# EAGLE schematic star (EAGLE 9.6.2)
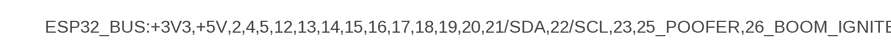
[diagram p0: schematic, sheet 1, part 1 of 2]
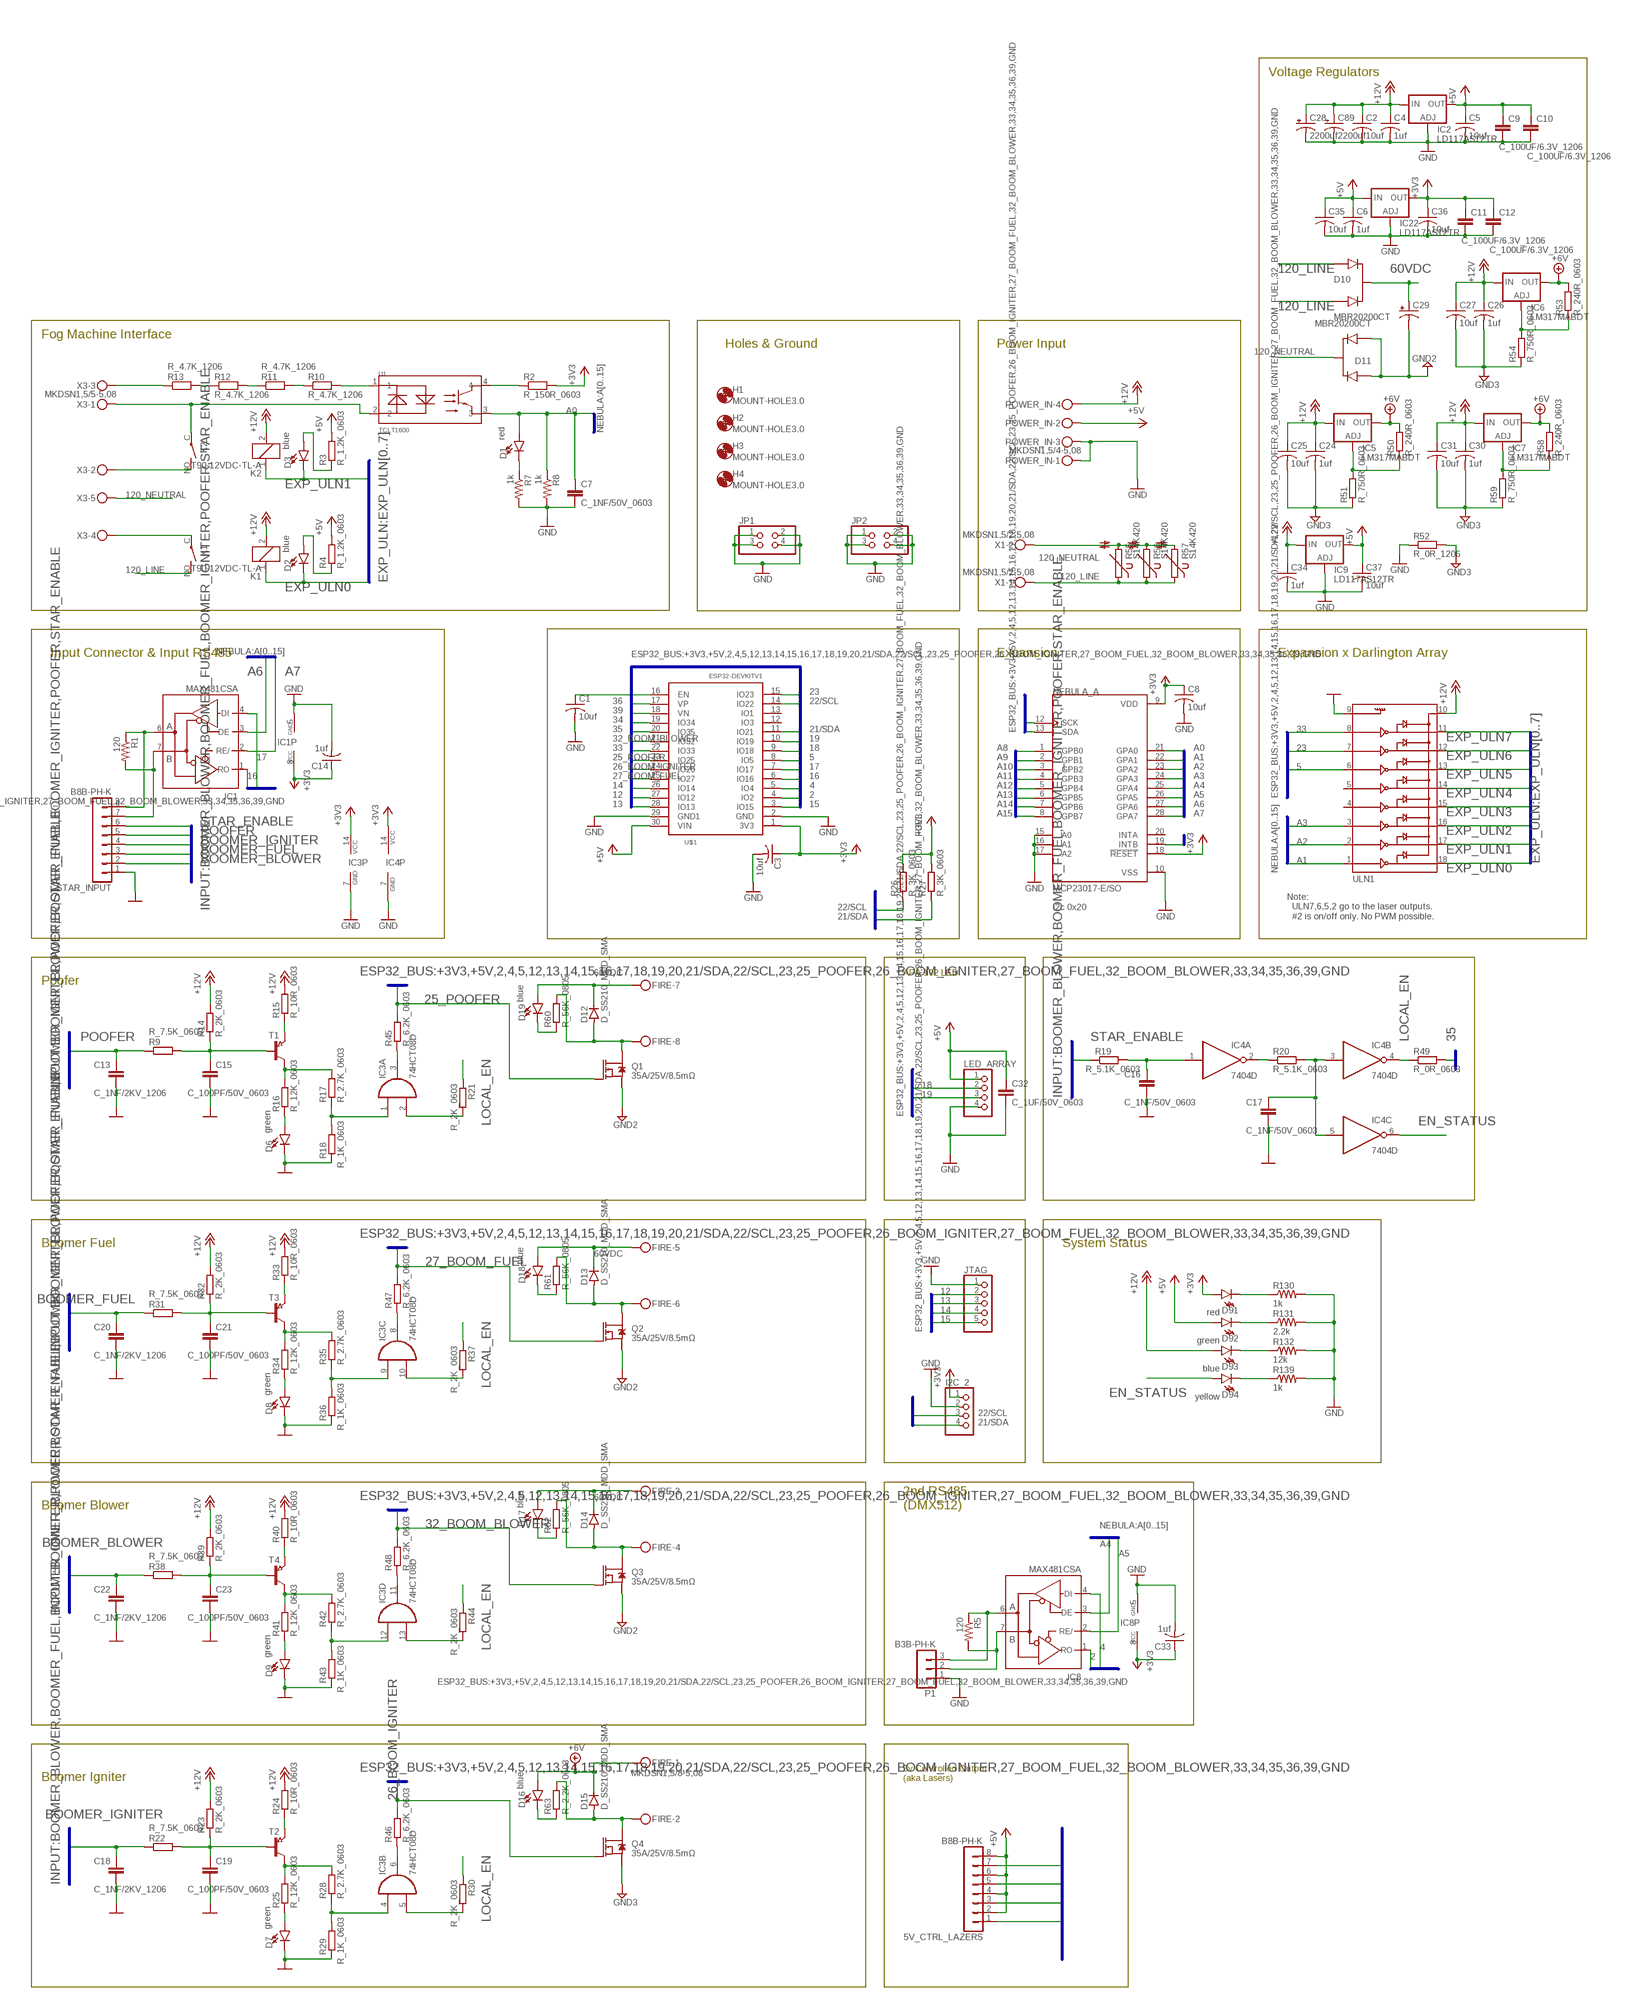
[diagram p1: schematic, sheet 1, part 2 of 2]

## Parts
5V_CTRL_LAZERS  B8B-PH-K  [B8B-PH-K]
C1  10uf  C-USC0603  [C0603]
C2  10uf  C-USC0603  [C0603]
C3  10uf  C-USC0603  [C0603]
C4  1uf  C-USC0805  [C0805]
C5  10uf  C-USC0603  [C0603]
C6  1uf  C-USC0805  [C0805]
C7  C_1NF/50V_0603  [C0603]
C8  10uf  C-USC0603  [C0603]
C9  C_100UF/6.3V_1206  [C1206]
C10  C_100UF/6.3V_1206  [C1206]
C11  C_100UF/6.3V_1206  [C1206]
C12  C_100UF/6.3V_1206  [C1206]
C13  C_1NF/2KV_1206  [C1206]
C14  1uf  C-USC0805  [C0805]
C15  C_100PF/50V_0603  [C0603]
C16  C_1NF/50V_0603  [C0603]
C17  C_1NF/50V_0603  [C0603]
C18  C_1NF/2KV_1206  [C1206]
C19  C_100PF/50V_0603  [C0603]
C20  C_1NF/2KV_1206  [C1206]
C21  C_100PF/50V_0603  [C0603]
C22  C_1NF/2KV_1206  [C1206]
C23  C_100PF/50V_0603  [C0603]
C24  1uf  C-USC0805  [C0805]
C25  10uf  C-USC0603  [C0603]
C26  1uf  C-USC0805  [C0805]
C27  10uf  C-USC0603  [C0603]
C28  2200uf  CPOL-USE5-13  [E5-13]
C29  CPOL-USE10-25  [EB25D]
C30  1uf  C-USC0805  [C0805]
C31  10uf  C-USC0603  [C0603]
C32  C_1UF/50V_0603  [C0603]
C33  1uf  C-USC0805  [C0805]
C34  1uf  C-USC0805  [C0805]
C35  10uf  C-USC0603  [C0603]
C36  10uf  C-USC0603  [C0603]
C37  10uf  C-USC0603  [C0603]
C89  2200uf  CPOL-USE5-13  [E5-13]
D1  red  LED0603  [LED-0603]
D2  blue  LED0603  [LED-0603]
D3  blue  LED0603  [LED-0603]
D6  green  LED0603  [LED-0603]
D7  green  LED0603  [LED-0603]
D8  green  LED0603  [LED-0603]
D9  green  LED0603  [LED-0603]
D10  MBR20200CT  [TO254P1050X476X2020-3]
D11  MBR20200CT  [TO254P1050X476X2020-3]
D12  D_SS210_MDD_SMA  [DO-214AC]
D13  D_SS210_MDD_SMA  [DO-214AC]
D14  D_SS210_MDD_SMA  [DO-214AC]
D15  D_SS210_MDD_SMA  [DO-214AC]
D16  blue  LED0603  [LED-0603]
D17  blue  LED0603  [LED-0603]
D18  blue  LED0603  [LED-0603]
D19  blue  LED0603  [LED-0603]
D91  red  LED0603  [LED-0603]
D92  green  LED0603  [LED-0603]
D93  blue  LED0603  [LED-0603]
D94  yellow  LED0603  [LED-0603]
FIRE  MKDSN1,5/8-5,08  [MKDSN1,5/8-5,08]
H1  MOUNT-HOLE3.0  [3,0]
H2  MOUNT-HOLE3.0  [3,0]
H3  MOUNT-HOLE3.0  [3,0]
H4  MOUNT-HOLE3.0  [3,0]
I2C_2  PINHD-1X4  [1X04]
IC1  MAX481CSA  [SO08]
IC2  LD117AS12TR  [SOT223]
IC3  74HCT08D  [SO14]
IC4  7404D  [SO14]
IC5  LM317MABDT  [DPACK]
IC6  LM317MABDT  [DPACK]
IC7  LM317MABDT  [DPACK]
IC8  MAX481CSA  [SO08]
IC9  LD117AS12TR  [SOT223]
IC22  LD117AS12TR  [SOT223]
JP1  PINHD-2X2  [2X02]
JP2  PINHD-2X2  [2X02]
JTAG  PINHD-1X5  [1X05]
K1  T90-12VDC-TL-A  JT1A-PCB-DC12V  [JT1A-PCB]
K2  T90-12VDC-TL-A  JT1A-PCB-DC12V  [JT1A-PCB]
LED_ARRAY  PINHD-1X4  [1X04]
NEBULA_A  MCP23017-E/SO  [SOIC127P1030X265-28N]
P1  B3B-PH-K  [B3B-PH-K]
POWER_IN  MKDSN1,5/4-5,08  [MKDSN1,5/4-5,08]
Q1  35A/25V/8.5mΩ  MOSFET-NCH-FDD8780  [DPAK]
Q2  35A/25V/8.5mΩ  MOSFET-NCH-FDD8780  [DPAK]
Q3  35A/25V/8.5mΩ  MOSFET-NCH-FDD8780  [DPAK]
Q4  35A/25V/8.5mΩ  MOSFET-NCH-FDD8780  [DPAK]
R1  120  R-US_R0603  [R0603]
R2  R_150R_0603  [R0603]
R3  R_1.2K_0603  [R0603]
R4  R_1.2K_0603  [R0603]
R5  120  R-US_R0603  [R0603]
R7  1k  R-US_R0603  [R0603]
R8  1k  R-US_R0603  [R0603]
R9  R_7.5K_0603  [R0603]
R10  R_4.7K_1206  [R1206]
R11  R_4.7K_1206  [R1206]
R12  R_4.7K_1206  [R1206]
R13  R_4.7K_1206  [R1206]
R14  R_2K_0603  [R0603]
R15  R_10R_0603  [R0603]
R16  R_12K_0603  [R0603]
R17  R_2.7K_0603  [R0603]
R18  R_1K_0603  [R0603]
R19  R_5.1K_0603  [R0603]
R20  R_5.1K_0603  [R0603]
R21  R_2K_0603  [R0603]
R22  R_7.5K_0603  [R0603]
R23  R_2K_0603  [R0603]
R24  R_10R_0603  [R0603]
R25  R_12K_0603  [R0603]
R26  R_3K_0603  [R0603]
R27  R_3K_0603  [R0603]
R28  R_2.7K_0603  [R0603]
R29  R_1K_0603  [R0603]
R30  R_2K_0603  [R0603]
R31  R_7.5K_0603  [R0603]
R32  R_2K_0603  [R0603]
R33  R_10R_0603  [R0603]
R34  R_12K_0603  [R0603]
R35  R_2.7K_0603  [R0603]
R36  R_1K_0603  [R0603]
R37  R_2K_0603  [R0603]
R38  R_7.5K_0603  [R0603]
R39  R_2K_0603  [R0603]
R40  R_10R_0603  [R0603]
R41  R_12K_0603  [R0603]
R42  R_2.7K_0603  [R0603]
R43  R_1K_0603  [R0603]
R44  R_2K_0603  [R0603]
R45  R_6.2K_0603  [R0603]
R46  R_6.2K_0603  [R0603]
R47  R_6.2K_0603  [R0603]
R48  R_6.2K_0603  [R0603]
R49  R_0R_0603  [R0603]
R50  R_240R_0603  [R0603]
R51  R_750R_0603  [R0603]
R52  R_0R_1206  [R1206]
R53  R_240R_0603  [R0603]
R54  R_750R_0603  [R0603]
R55  S14K420  [S14K420]
R56  S14K420  [S14K420]
R57  S14K420  [S14K420]
R58  R_240R_0603  [R0603]
R59  R_750R_0603  [R0603]
R60  R_56K_0805  [R0805]
R61  R_56K_0805  [R0805]
R62  R_56K_0805  [R0805]
R63  R_2.2K_0603  [R0603]
R130  1k  R-US_R0603  [R0603]
R131  2.2k  R-US_R0603  [R0603]
R132  12k  R-US_R0603  [R0603]
R139  1k  R-US_R0603  [R0603]
STAR_INPUT  B8B-PH-K  [B8B-PH-K]
T1  T_PNP_MMBT5401_CHANGJ_SOT23-BEC  [SOT23]
T2  T_PNP_MMBT5401_CHANGJ_SOT23-BEC  [SOT23]
T3  T_PNP_MMBT5401_CHANGJ_SOT23-BEC  [SOT23]
T4  T_PNP_MMBT5401_CHANGJ_SOT23-BEC  [SOT23]
U1  TCLT1600  [SOP254P1015X230-4N]
U$1  ESP32DEVKITV1  [ESP32-DEVKITV1]
ULN1  ULN2803SOICW  [SO18L]
X1  MKDSN1,5/2-5,08  [MKDSN1,5/2-5,08]
X3  MKDSN1,5/5-5,08  [MKDSN1,5/5-5,08]

## Nets
2: IC8.1(RO) U$1.4(IO2)
4: IC8.4(DI) U$1.5(IO4)
5: U$1.8(IO5) ULN1.6
12: JTAG.2 U$1.27(IO12)
13 [3V3]: JTAG.3 U$1.28(IO13)
14: JTAG.4 U$1.26(IO14)
15: JTAG.5 U$1.3(IO15)
16: IC1.1(RO) U$1.6(IO16)
17: IC1.4(DI) U$1.7(IO17)
18: LED_ARRAY.2 U$1.9(IO18)
19: LED_ARRAY.3 U$1.10(IO19)
21/SDA: I2C_2.4 NEBULA_A.13(SDA) R27.1 U$1.11(IO21)
22/SCL: I2C_2.3 NEBULA_A.12(SCK) R26.1 U$1.14(IO22)
23: U$1.15(IO23) ULN1.7
25_POOFER: Q1.1(G) R45.2 U$1.23(IO25)
26_BOOM_IGNITER: Q4.1(G) R46.2 U$1.24(IO26)
27_BOOM_FUEL: Q2.1(G) R47.2 U$1.25(IO27)
32_BOOM_BLOWER: Q3.1(G) R48.2 U$1.21(IO32)
33: U$1.22(IO33) ULN1.8
34: NEBULA_A.19(INTB) U$1.19(IO34)
35: R49.2 U$1.20(IO35)
36: U$1.17(VP)
39: U$1.18(VN)
60VDC [60V]: C29.+ D10.2(C) D12.C D13.C D14.C D17.A D18.A D19.A FIRE.3 FIRE.5 FIRE.7
120_LINE [120VAC_PWR]: D10.1(A1) D10.3(A2) K1.NO(S) R55.1 R56.1 R57.1 X1.1
120_NEUTRAL [120VAC_PWR]: D11.2(C) R55.2 R56.2 R57.2 X1.2 X3.5
+3V3 [3V3]: C3.1 C8.1 C11.1 C12.1 C14.1 C33.1 C36.1 D91.A I2C_2.1 IC1.8(VCC) IC3.14(P:VCC) IC4.14(P:VCC) IC8.8(VCC) IC22.4(OUT) NEBULA_A.9(VDD) NEBULA_A.18(!RESET) R2.2 R26.2 R27.2 U$1.1(3V3)
+5V [5V]: 5V_CTRL_LAZERS.2 5V_CTRL_LAZERS.4 5V_CTRL_LAZERS.6 5V_CTRL_LAZERS.8 C5.1 C6.1 C9.1 C10.1 C32.1 C35.1 C37.1 D92.A IC2.4(OUT) IC9.4(OUT) IC22.3(IN) LED_ARRAY.1 POWER_IN.2 R3.2 R4.2 U$1.30(VIN)
+6V: D15.C D16.A FIRE.1 IC5.4(OUT) IC6.4(OUT) IC7.4(OUT) R50.2 R53.2 R58.2
+12V [12V]: C2.1 C4.1 C24.1 C25.1 C26.1 C27.1 C28.+ C30.1 C31.1 C34.1 C89.+ D93.A IC2.3(IN) IC5.3(IN) IC6.3(IN) IC7.3(IN) IC9.3(IN) K1.2 K2.2 POWER_IN.4 R14.2 R15.2 R23.2 R24.2 R32.2 R33.2 R39.2 R40.2 ULN1.10
A0: C7.1 D1.A NEBULA_A.21(GPA0) R8.1 U1.3
A1: NEBULA_A.22(GPA1) ULN1.1
A2: NEBULA_A.23(GPA2) ULN1.2
A3: NEBULA_A.24(GPA3) ULN1.3
A4: IC8.3(DE) NEBULA_A.25(GPA4)
A5: IC8.2(RE/) NEBULA_A.26(GPA5)
A6: IC1.3(DE) NEBULA_A.27(GPA6)
A7: IC1.2(RE/) NEBULA_A.28(GPA7)
A8: NEBULA_A.1(GPB0)
A9: NEBULA_A.2(GPB1)
A10: NEBULA_A.3(GPB2)
A11: NEBULA_A.4(GPB3)
A12: NEBULA_A.5(GPB4)
A13: NEBULA_A.6(GPB5)
A14: NEBULA_A.7(GPB6)
A15: NEBULA_A.8(GPB7)
BOOMER_BLOWER: C22.1 R38.1 STAR_INPUT.2
BOOMER_FUEL: C20.1 R31.1 STAR_INPUT.3
BOOMER_IGNITER: C18.1 R22.1 STAR_INPUT.4
EN_STATUS: D94.A IC4.6(C:O)
EXP_ULN0: D2.C K1.1 ULN1.18
EXP_ULN1: D3.C K2.1 ULN1.17
EXP_ULN2: 5V_CTRL_LAZERS.7 ULN1.16
EXP_ULN3: ULN1.15
EXP_ULN4: ULN1.14
EXP_ULN5: 5V_CTRL_LAZERS.5 ULN1.13
EXP_ULN6: 5V_CTRL_LAZERS.3 ULN1.12
EXP_ULN7: 5V_CTRL_LAZERS.1 ULN1.11
GND [GND]: C1.2 C2.2 C3.2 C4.2 C5.2 C6.2 C7.2 C8.2 C9.2 C10.2 C11.2 C12.2 C13.2 C14.2 C15.2 C16.2 C17.2 C18.2 C19.2 C20.2 C21.2 C22.2 C23.2 C28.- C32.2 C33.2 C34.2 C35.2 C36.2 C37.2 C89.- D6.C D7.C D8.C D9.C I2C_2.2 IC1.5(GND) IC2.1(ADJ) IC3.7(P:GND) IC4.7(P:GND) IC8.5(GND) IC9.1(ADJ) IC22.1(ADJ) JP1.1 JP1.2 JP1.3 JP1.4 JP2.1 JP2.2 JP2.3 JP2.4 JTAG.1 LED_ARRAY.4 NEBULA_A.10(VSS) NEBULA_A.15(A0) NEBULA_A.16(A1) NEBULA_A.17(A2) P1.1 POWER_IN.1 POWER_IN.3 R7.2 R8.2 R18.1 R29.1 R36.1 R43.1 R52.1 R130.2 R131.2 R132.2 R139.2 STAR_INPUT.1 U$1.2(GND) U$1.29(GND1) ULN1.9
GND2 [60V]: C29.- D11.1(A1) D11.3(A2) Q1.3(S) Q2.3(S) Q3.3(S)
GND3: C24.2 C25.2 C26.2 C27.2 C30.2 C31.2 Q4.3(S) R51.1 R52.2 R54.1 R59.1
LOCAL_EN: IC4.4(B:O) R21.1 R30.1 R37.1 R44.1 R49.1
N$1: C1.1 U$1.16(EN)
N$2: R2.1 U1.4
N$3: D2.A R4.1
N$4: D3.A R3.1
N$5: IC8.7(B) P1.2 R5.2
N$6: IC8.6(A) P1.3 R5.1
N$7 [120VAC]: R13.1 X3.3
N$8 [120VAC]: R12.1 R13.2
N$9 [120VAC]: R11.1 R12.2
N$10 [120VAC]: R10.1 R11.2
N$11 [120VAC]: R10.2 U1.1
N$12: D1.C R7.1
N$13 [120VAC]: K2.NO(S) X3.2
N$14 [120VAC_PWR]: K1.C(P) X3.4
N$15 [120VAC]: K2.C(P) U1.2 X3.1
N$16: R16.2 R17.2 T1.3(C)
N$17: C15.1 R9.2 R14.1 T1.1(B)
N$18: D6.A R16.1
N$19: IC3.1(A:I0) R17.1 R18.2
N$20: R15.1 T1.2(E)
N$21: IC4.2(A:O) R20.1
N$22: C17.1 IC4.3(B:I) IC4.5(C:I) R20.2
N$23: C16.1 IC4.1(A:I) R19.2
N$24: IC3.2(A:I1) R21.2
N$25: C19.1 R22.2 R23.1 T2.1(B)
N$26: R25.2 R28.2 T2.3(C)
N$27: D7.A R25.1
N$28: IC3.4(B:I0) R28.1 R29.2
N$29: R24.1 T2.2(E)
N$30: IC3.5(B:I1) R30.2
N$31: C21.1 R31.2 R32.1 T3.1(B)
N$32: R34.2 R35.2 T3.3(C)
N$33: D8.A R34.1
N$34: IC3.9(C:I0) R35.1 R36.2
N$35: R33.1 T3.2(E)
N$36: IC3.10(C:I1) R37.2
N$37: C23.1 R38.2 R39.1 T4.1(B)
N$38: R41.2 R42.2 T4.3(C)
N$39: D9.A R41.1
N$40: IC3.12(D:I0) R42.1 R43.2
N$41: R40.1 T4.2(E)
N$42: IC3.13(D:I1) R44.2
N$43: IC3.3(A:O) R45.1
N$44: IC3.6(B:O) R46.1
N$45: IC3.8(C:O) R47.1
N$46: IC3.11(D:O) R48.1
N$47: D13.A FIRE.6 Q2.4(D) R61.2
N$48: IC6.1(ADJ) R53.1 R54.2
N$49: D12.A FIRE.8 Q1.4(D) R60.2
N$50: IC5.1(ADJ) R50.1 R51.2
N$51: D14.A FIRE.4 Q3.4(D) R62.2
N$52: D15.A FIRE.2 Q4.4(D) R63.2
N$53: IC7.1(ADJ) R58.1 R59.2
N$54: D16.C R63.1
N$55: D17.C R62.1
N$56: D18.C R61.1
N$57: D19.C R60.1
N$108: IC1.7(B) R1.2 STAR_INPUT.7
N$109: IC1.6(A) R1.1 STAR_INPUT.8
N$156: D91.C R130.1
N$157: D92.C R131.1
N$158: D93.C R132.1
N$159: D94.C R139.1
POOFER: C13.1 R9.1 STAR_INPUT.5
STAR_ENABLE: R19.1 STAR_INPUT.6
Unconnected: IC4.8(D:O) IC4.9(D:I) IC4.10(E:O) IC4.11(E:I) IC4.12(F:O) IC4.13(F:I) NEBULA_A.20(INTA) U$1.12(IO3) U$1.13(IO1) ULN1.4 ULN1.5

## Buses
ESP32_BUS:+3V3,+5V,2,4,5,12,13,14,15,16,17,18,19,20,21/SDA,22/SCL,23,25_POOFER,26_BOOM_IGNITER,27_BOOM_FUEL,32_BOOM_BLOWER,33,34,35,36,39,GND
NEBULA:A[0..15]
EXP_ULN:EXP_ULN[0..7]
INPUT:BOOMER_BLOWER,BOOMER_FUEL,BOOMER_IGNITER,POOFER,STAR_ENABLE

## Notes on the sheet
- Voltage Regulators
- Fog Machine Interface
- Holes & Ground | Power Input
- Input Connector & Input RS485 | Expansion | Expansion x Darlington Array
- i2c 0x20
- Note:
    ULN7,6,5,2 go to the laser outputs.
    #2 is on/off only. No PWM possible.
- APA 102 LED
- Poofer
- Boomer Fuel | System Status
- Boomer Blower
- 2nd RS485
  (DMX512)
- Boomer Igniter
- 5v Controlled Output
  (aka Lasers)

## Library data of the parts
5V_CTRL_LAZERS STAR_INPUT = con-jst-ph:B8B-PH-K: HEADER
C1-C3 C5 C8 C25 C27 C31 C35-C37 = rcl:C-US: CAPACITOR, American symbol; LCSC_PART: C19702; SPICEPREFIX: C
C4 C6 C14 C24 C26 C30 C33 C34 = rcl:C-US: CAPACITOR, American symbol; LCSC_PART: C15849; SPICEPREFIX: C
C7 C16 C17 = JLC PCB Basic Parts_loc:C_: Capacitor General purpose SMD Capacitor; LCSC_DATASHEET: https://datasheet.lcsc.com/lcsc/1811071810_Samsung-Electro-Mechanics-CL10B102KB8NNNC_C1588.pdf; LCSC_PART: C1588; LCSC_ROTATION_CCW: 0; LCSC_STOCK: 2243141; PROPERTIES: 50V 1nF X7R ±10% 0603 ROHS
C9-C12 = JLC PCB Basic Parts_loc:C_: Capacitor General purpose SMD Capacitor; LCSC_DATASHEET: https://datasheet.lcsc.com/lcsc/1810301816_Samsung-Electro-Mechanics-CL31A107MQHNNNE_C15008.pdf; LCSC_PART: C15008; LCSC_ROTATION_CCW: 0; LCSC_STOCK: 547696; PROPERTIES: 6.3V 100uF X5R ±20% 1206 ROHS
C13 C18 C20 C22 = JLC PCB Basic Parts_loc:C_: Capacitor General purpose SMD Capacitor; LCSC_DATASHEET: https://datasheet.lcsc.com/lcsc/1810311314_FH-Guangdong-Fenghua-Advanced-Tech-1206B102K202NT_C9196.pdf; LCSC_PART: C9196; LCSC_ROTATION_CCW: 0; LCSC_STOCK: 8943689; PROPERTIES: 2kV 1nF X7R ±10% 1206 ROHS
C15 C19 C21 C23 = JLC PCB Basic Parts_loc:C_: Capacitor General purpose SMD Capacitor; LCSC_DATASHEET: https://datasheet.lcsc.com/lcsc/1811151136_Samsung-Electro-Mechanics-CL10C101JB8NNNC_C14858.pdf; LCSC_PART: C14858; LCSC_ROTATION_CCW: 0; LCSC_STOCK: 2152181; PROPERTIES: 50V 100pF C0G ±5% 0603 ROHS
C28 C89 = rcl:CPOL-US: POLARIZED CAPACITOR, American symbol; DIST: https://amzn.to/3iR84VS; SPICEPREFIX: C
C29 = rcl:CPOL-US: POLARIZED CAPACITOR, American symbol; SPICEPREFIX: C
C32 = JLC PCB Basic Parts_loc:C_: Capacitor General purpose SMD Capacitor; LCSC_DATASHEET: https://datasheet.lcsc.com/lcsc/1810261812_Samsung-Electro-Mechanics-CL10A105KB8NNNC_C15849.pdf; LCSC_PART: C15849; LCSC_ROTATION_CCW: 0; LCSC_STOCK: 14650365; PROPERTIES: 50V 1uF X5R ±10% 0603 ROHS
D1 D91 = SparkFun-LED:LED: LED (Generic) Standard schematic elements and footprints for 5mm, 3mm, 1206, and 0603 sized LEDs. Generic LEDs with no color specified.; JLC_ROTATION: 180; LCSC_PART: C2286
D2 D3 D16-D19 D93 = SparkFun-LED:LED: LED (Generic) Standard schematic elements and footprints for 5mm, 3mm, 1206, and 0603 sized LEDs. Generic LEDs with no color specified.; JLC_ROTATION: 180; LCSC_PART: C72041
D6-D9 D92 = SparkFun-LED:LED: LED (Generic) Standard schematic elements and footprints for 5mm, 3mm, 1206, and 0603 sized LEDs. Generic LEDs with no color specified.; JLC_ROTATION: 180; LCSC_PART: C72043
D10 D11 = MBR20200CT:MBR20200CT: Check availability <https://pricing.snapeda.com/parts/MBR20200CT/Taiwan%20Semiconductor/view-part?ref=eda>; AVAILABILITY: In Stock; DESCRIPTION: 20A, 200V, Schottky Rectifier; MF: Taiwan Semiconductor; MP: MBR20200CT; PACKAGE: TO-220AB-3 Taiwan Semiconductor; PRICE: None; PURCHASE-URL: https://pricing.snapeda.com/search/part/MBR20200CT/?ref=eda
D12-D15 = JLC PCB Basic Parts_loc:D_: Diode; LCSC_DATASHEET: https://datasheet.lcsc.com/lcsc/1811071613_MDD-Microdiode-Electronics--SS210_C14996.pdf; LCSC_PART: C14996; LCSC_ROTATION_CCW: 180; LCSC_STOCK: 307807; PROPERTIES: 100V 850mV@2A 2A SMA(DO-214AC) Schottky Barrier Diodes (SBD) ROHS
D94 = SparkFun-LED:LED: LED (Generic) Standard schematic elements and footprints for 5mm, 3mm, 1206, and 0603 sized LEDs. Generic LEDs with no color specified.; JLC_ROTATION: 180; LCSC_PART: C72038
FIRE = con-phoenix-508:MKDSN1,5/8-5,08: MKDSN 1,5/ 8-5,08 Printklemme Nennstrom: 13,5 A Nennspannung: 250 V Rastermaß: 5,08 mm Polzahl: 8 Anschlussart: Schraubanschluss Montage: Löten Anschlussrichtung Leiter/Platine: 0 ° Artikelnummer: 1729186 Source: http://eshop.phoenixcontact.com .. 1729186.pdf
H1-H4 = holes:MOUNT-HOLE: MOUNTING HOLE with drill center marker
I2C_2 LED_ARRAY = pinhead:PINHD-1X4: PIN HEADER
IC1 IC8 = maxim:MAX481CSA: RS485 TRANSEIVER; LCSC_PART: C8963; MF: MAXIM; MPN: MAX481CSA; OC_FARNELL: unknown; OC_NEWARK: 90C3817
IC2 IC9 = v-reg:LD117A?*: Low drop fixed and adjustable positive voltage regulators 1 A Source: http://www.st.com/stonline/products/literature/ds/7194/ld1117axx.pdf; LCSC_PART: C6187; PRICE: 0.5
IC3 = 74xx-eu:74*08: Quad 2-input AND gate; LCSC_PART: C5593
IC4 = 74xx-us:74*04: Hex INVERTER; LCSC_PART: C5590
IC5-IC7 = v-reg:LM317?*: 500 mA Adjustable Output Positive Voltage Regulator Source: http://www.onsemi.co.jp .. LM317M-D.PDF; LCSC_PART: C75510; PRICE: 0.5
IC22 = v-reg:LD117A?*: Low drop fixed and adjustable positive voltage regulators 1 A Source: http://www.st.com/stonline/products/literature/ds/7194/ld1117axx.pdf; LCSC_PART: C347222; PRICE: 0.5
JP1 JP2 = pinhead:PINHD-2X2: PIN HEADER
JTAG = pinhead:PINHD-1X5: PIN HEADER
K1 K2 = relay:JT1A?-*: COMPACT ECONOMICAL 30 AMP. RELAY NAiS Source: http://www.mew-europe.com/.. en_ds_61212_0000.pdf; OC_FARNELL: unknown; OC_NEWARK: unknown
NEBULA_A = MCP23017-E_SO:MCP23017-E/SO: MCP23017 Series 5.5 V 1.7 MHz SMT 16-Bit I2C I/O Expander - SOIC-28 Check availability <https://pricing.snapeda.com/parts/MCP23017-E/SO/Microchip/view-part?ref=eda>; AVAILABILITY: In Stock; DESCRIPTION: I/O Expander 16 I²C 1.7 MHz 28-SOIC; LCSC_PART: C629440; MF: Microchip; MP: MCP23017-E/SO; PACKAGE: SOIC-28 Microchip; PRICE: None; PURCHASE-URL: https://pricing.snapeda.com/search/part/MCP23017-E/SO/?ref=eda
P1 = con-jst-ph:B3B-PH-K: HEADER
POWER_IN = con-phoenix-508:MKDSN1,5/4-5,08: MKDSN 1,5/ 4-5,08 Printklemme Nennstrom: 13,5 A Nennspannung: 250 V Rastermaß: 5,08 mm Polzahl: 4 Anschlussart: Schraubanschluss Montage: Löten Anschlussrichtung Leiter/Platine: 0 ° Artikelnummer: 1729144 Source: http://eshop.phoenixcontact.com .. 1729144.pdf
Q1-Q4 = SparkFun-DiscreteSemi:MOSFET-NCH: N-channel MOSFETs Voltage controlled devices that allow control of high current outputs. SparkFun Products: SparkFun OpenScale <https://www.sparkfun.com/products/13261> SparkFun Digital Sandbox <https://www.sparkfun.com/products/12651> SparkFun Monster Moto Shield <https://www.sparkfun.com/products/10182> SparkFun MOSFET Power Controller <https://www.sparkfun.com/products/11214>; LCSC_PART: C2995335; PROD_ID: TRANS-09984
R1 R5 = rcl:R-US_: RESISTOR, American symbol; LCSC_PART: C22787; SPICEPREFIX: R
R2 = JLC PCB Basic Parts_loc:R_: Resistor General purpose SMD Resistor; LCSC_DATASHEET: https://datasheet.lcsc.com/lcsc/2110252030_UNI-ROYAL-Uniroyal-Elec-0603WAF1500T5E_C22808.pdf; LCSC_PART: C22808; LCSC_ROTATION_CCW: 0; LCSC_STOCK: 466893; PROPERTIES: ±1% 1/10W Thick Film Resistors 75V ±100ppm -55°C~+155°C 150Ohm 0603 ROHS
R3 R4 = JLC PCB Basic Parts_loc:R_: Resistor General purpose SMD Resistor; LCSC_DATASHEET: https://datasheet.lcsc.com/lcsc/2110252030_UNI-ROYAL-Uniroyal-Elec-0603WAF1201T5E_C22765.pdf; LCSC_PART: C22765; LCSC_ROTATION_CCW: 0; LCSC_STOCK: 476320; PROPERTIES: ±1% 1/10W Thick Film Resistors 75V ±100ppm -55°C~+155°C 1.2kOhm 0603 ROHS
R7 R8 R130 R139 = rcl:R-US_: RESISTOR, American symbol; LCSC_PART: C21190; SPICEPREFIX: R
R9 R22 R31 R38 = JLC PCB Basic Parts_loc:R_: Resistor General purpose SMD Resistor; LCSC_DATASHEET: https://datasheet.lcsc.com/lcsc/2110252130_UNI-ROYAL-Uniroyal-Elec-0603WAF7501T5E_C23234.pdf; LCSC_PART: C23234; LCSC_ROTATION_CCW: 0; LCSC_STOCK: 230039; PROPERTIES: ±1% 1/10W Thick Film Resistors 75V ±100ppm -55°C~+155°C 7.5kOhm 0603 ROHS
R10-R13 = JLC PCB Basic Parts_loc:R_: Resistor General purpose SMD Resistor; LCSC_DATASHEET: https://datasheet.lcsc.com/lcsc/2110251930_UNI-ROYAL-Uniroyal-Elec-1206W4F4701T5E_C17936.pdf; LCSC_PART: C17936; LCSC_ROTATION_CCW: 0; LCSC_STOCK: 161665; PROPERTIES: ±1% 250mW Thick Film Resistors 200V ±100ppm -55°C~+155°C 4.7kOhm 1206 ROHS
R14 R21 R23 R30 R32 R37 R39 R44 = JLC PCB Basic Parts_loc:R_: Resistor General purpose SMD Resistor; LCSC_DATASHEET: https://datasheet.lcsc.com/lcsc/2110252130_UNI-ROYAL-Uniroyal-Elec-0603WAF2001T5E_C22975.pdf; LCSC_PART: C22975; LCSC_ROTATION_CCW: 0; LCSC_STOCK: 3372290; PROPERTIES: ±1% 1/10W Thick Film Resistors 75V ±100ppm -55°C~+155°C 2kOhm 0603 ROHS
R15 R24 R33 R40 = JLC PCB Basic Parts_loc:R_: Resistor General purpose SMD Resistor; LCSC_DATASHEET: https://datasheet.lcsc.com/lcsc/2110252030_UNI-ROYAL-Uniroyal-Elec-0603WAF100JT5E_C22859.pdf; LCSC_PART: C22859; LCSC_ROTATION_CCW: 0; LCSC_STOCK: 2733989; PROPERTIES: ±1% 1/10W Thick Film Resistors 75V ±400ppm -55°C~+155°C 10Ohm 0603 ROHS
R16 R25 R34 R41 = JLC PCB Basic Parts_loc:R_: Resistor General purpose SMD Resistor; LCSC_DATASHEET: https://datasheet.lcsc.com/lcsc/2110252030_UNI-ROYAL-Uniroyal-Elec-0603WAF1202T5E_C22790.pdf; LCSC_PART: C22790; LCSC_ROTATION_CCW: 0; LCSC_STOCK: 256802; PROPERTIES: ±1% 1/10W Thick Film Resistors 75V ±100ppm -55°C~+155°C 12kOhm 0603 ROHS
R17 R28 R35 R42 = JLC PCB Basic Parts_loc:R_: Resistor General purpose SMD Resistor; LCSC_DATASHEET: https://datasheet.lcsc.com/lcsc/2110251730_UNI-ROYAL-Uniroyal-Elec-0603WAF2701T5E_C13167.pdf; LCSC_PART: C13167; LCSC_ROTATION_CCW: 0; LCSC_STOCK: 65542; PROPERTIES: ±1% 1/10W Thick Film Resistors 75V ±100ppm -55°C~+155°C 2.7kOhm 0603 ROHS
R18 R29 R36 R43 = JLC PCB Basic Parts_loc:R_: Resistor General purpose SMD Resistor; LCSC_DATASHEET: https://datasheet.lcsc.com/lcsc/2110252030_UNI-ROYAL-Uniroyal-Elec-0603WAF1001T5E_C21190.pdf; LCSC_PART: C21190; LCSC_ROTATION_CCW: 0; LCSC_STOCK: 5175299; PROPERTIES: ±1% 1/10W Thick Film Resistors 75V ±100ppm -55°C~+155°C 1kOhm 0603 ROHS
R19 R20 = JLC PCB Basic Parts_loc:R_: Resistor General purpose SMD Resistor; LCSC_DATASHEET: https://datasheet.lcsc.com/lcsc/2110252130_UNI-ROYAL-Uniroyal-Elec-0603WAF5101T5E_C23186.pdf; LCSC_PART: C23186; LCSC_ROTATION_CCW: 0; LCSC_STOCK: 2912883; PROPERTIES: ±1% 1/10W Thick Film Resistors 75V ±100ppm -55°C~+155°C 5.1kOhm 0603 ROHS
R26 R27 = JLC PCB Basic Parts_loc:R_: Resistor General purpose SMD Resistor; LCSC_DATASHEET: https://datasheet.lcsc.com/lcsc/2110251730_UNI-ROYAL-Uniroyal-Elec-0603WAF3001T5E_C4211.pdf; LCSC_PART: C4211; LCSC_ROTATION_CCW: 0; LCSC_STOCK: 740793; PROPERTIES: ±1% 1/10W Thick Film Resistors 75V ±100ppm -55°C~+155°C 3kOhm 0603 ROHS
R45-R48 = JLC PCB Basic Parts_loc:R_: Resistor General purpose SMD Resistor; LCSC_DATASHEET: https://datasheet.lcsc.com/lcsc/2110251730_UNI-ROYAL-Uniroyal-Elec-0603WAF6201T5E_C4260.pdf; LCSC_PART: C4260; LCSC_ROTATION_CCW: 0; LCSC_STOCK: 176806; PROPERTIES: ±1% 1/10W Thick Film Resistors 75V ±100ppm -55°C~+155°C 6.2kOhm 0603 ROHS
R49 = JLC PCB Basic Parts_loc:R_: Resistor General purpose SMD Resistor; LCSC_DATASHEET: https://datasheet.lcsc.com/lcsc/2110252030_UNI-ROYAL-Uniroyal-Elec-0603WAF0000T5E_C21189.pdf; LCSC_PART: C21189; LCSC_ROTATION_CCW: 0; LCSC_STOCK: 891306; PROPERTIES: ±1% 1/10W Thick Film Resistors 75V -55°C~+155°C 0Ohm 0603 ROHS
R50 R53 R58 = JLC PCB Basic Parts_loc:R_: Resistor General purpose SMD Resistor; LCSC_DATASHEET: https://datasheet.lcsc.com/lcsc/2110252230_UNI-ROYAL-Uniroyal-Elec-0603WAF2400T5E_C23350.pdf; LCSC_PART: C23350; LCSC_ROTATION_CCW: 0; LCSC_STOCK: 173950; PROPERTIES: ±1% 1/10W Thick Film Resistors 75V ±100ppm -55°C~+155°C 240Ohm 0603 ROHS
R51 R54 R59 = JLC PCB Basic Parts_loc:R_: Resistor General purpose SMD Resistor; LCSC_DATASHEET: https://datasheet.lcsc.com/lcsc/2110252130_UNI-ROYAL-Uniroyal-Elec-0603WAF7500T5E_C23241.pdf; LCSC_PART: C23241; LCSC_ROTATION_CCW: 0; LCSC_STOCK: 59351; PROPERTIES: ±1% 1/10W Thick Film Resistors 75V ±100ppm -55°C~+155°C 750Ohm 0603 ROHS
R52 = JLC PCB Basic Parts_loc:R_: Resistor General purpose SMD Resistor; LCSC_DATASHEET: https://datasheet.lcsc.com/lcsc/2110251930_UNI-ROYAL-Uniroyal-Elec-1206W4F0000T5E_C17888.pdf; LCSC_PART: C17888; LCSC_ROTATION_CCW: 0; LCSC_STOCK: 399166; PROPERTIES: ±1% 250mW Thick Film Resistors 200V ±800ppm -55°C~+155°C 0Ohm 1206 ROHS
R55-R57 = varistor:S14K420: VARISTOR
R60-R62 = JLC PCB Basic Parts_loc:R_: Resistor General purpose SMD Resistor; LCSC_DATASHEET: https://datasheet.lcsc.com/lcsc/2110251830_UNI-ROYAL-Uniroyal-Elec-0805W8F5602T5E_C17756.pdf; LCSC_PART: C17756; LCSC_ROTATION_CCW: 0; LCSC_STOCK: 49272; PROPERTIES: ±1% 1/8W Thick Film Resistors 150V ±100ppm -55°C~+155°C 56kOhm 0805 ROHS
R63 = JLC PCB Basic Parts_loc:R_: Resistor General purpose SMD Resistor; LCSC_DATASHEET: https://datasheet.lcsc.com/lcsc/2110251730_UNI-ROYAL-Uniroyal-Elec-0603WAF2201T5E_C4190.pdf; LCSC_PART: C4190; LCSC_ROTATION_CCW: 0; LCSC_STOCK: 331536; PROPERTIES: ±1% 1/10W Thick Film Resistors 75V ±100ppm -55°C~+155°C 2.2kOhm 0603 ROHS
R131 = rcl:R-US_: RESISTOR, American symbol; LCSC_PART: C4190; SPICEPREFIX: R
R132 = rcl:R-US_: RESISTOR, American symbol; LCSC_PART: C22790; SPICEPREFIX: R
T1-T4 = JLC PCB Basic Parts_loc:T_PNP_: Transistor PNP; LCSC_DATASHEET: https://datasheet.lcsc.com/lcsc/1809140241_Changjiang-Electronics-Tech--CJ-MMBT5401_C8326.pdf; LCSC_PART: C8326; LCSC_ROTATION_CCW: 180; LCSC_STOCK: 367315; PROPERTIES: 150V 300mW 600mA 200@10mA,5V 100MHz 500mV@50mA,5mA PNP +150°C@(Tj) SOT-23(SOT-23-3) Bipolar Transistors - BJT ROHS
U1 = TCLT1600:TCLT1600: TCLT1600 Series Single Channel 5000 Vrms Phototransistor Optocoupler - SOP-4L Check availability <https://pricing.snapeda.com/parts/TCLT1600/Vishay%20Semiconductor/view-part?ref=eda>; AVAILABILITY: In Stock; DESCRIPTION: Optoisolator Transistor Output 5000Vrms 1 Channel 4-SOP (2.54mm); LCSC_PART: C553998; MF: Vishay Semiconductor; MP: TCLT1600; PACKAGE: LSOP-4 Vishay; PRICE: None; PURCHASE-URL: https://pricing.snapeda.com/search/part/TCLT1600/?ref=eda
U$1 = ESP32-DEVKITV1:ESP32DEVKITV1
ULN1 = SparkFun-IC-Special-Function:ULN2803: Darlington Driver(IC-07959, low stock) ULN2803 Darlington array. 500mA max per channel, 8-channel package. Spark Fun Electronics SKU : COM-00312; LCSC_PART: C9683
X1 = con-phoenix-508:MKDSN1,5/2-5,08: MKDSN 1,5/ 2-5,08 Printklemme Nennstrom: 13,5 A Nennspannung: 250 V Rastermaß: 5,08 mm Polzahl: 2 Anschlussart: Schraubanschluss Montage: Löten Anschlussrichtung Leiter/Platine: 0 ° Artikelnummer: 1729128 Source: http://eshop.phoenixcontact.com .. 1729128.pdf
X3 = con-phoenix-508:MKDSN1,5/5-5,08: MKDSN 1,5/ 5-5,08 Printklemme Nennstrom: 13,5 A Nennspannung: 250 V Rastermaß: 5,08 mm Polzahl: 5 Anschlussart: Schraubanschluss Montage: Löten Anschlussrichtung Leiter/Platine: 0 ° Artikelnummer: 1729157 Source: http://eshop.phoenixcontact.com .. 1729157.pdf

## Net classes
0 default: width 0.305 mm, clearance 0.254 mm
1 GND: width 0.508 mm, clearance 0.254 mm
2 12V: width 1.27 mm, clearance 0.254 mm
3 5V: width 0.508 mm, clearance 0.254 mm
4 3V3: width 0.508 mm, clearance 0.254 mm
5 12V_FUSED: width 0.635 mm, clearance 0.254 mm
6 120VAC_PWR: width 1.27 mm, clearance 0.508 mm
7 120VAC: width 1.27 mm, clearance 0.508 mm
8 60V: width 1.27 mm, clearance 0.508 mm